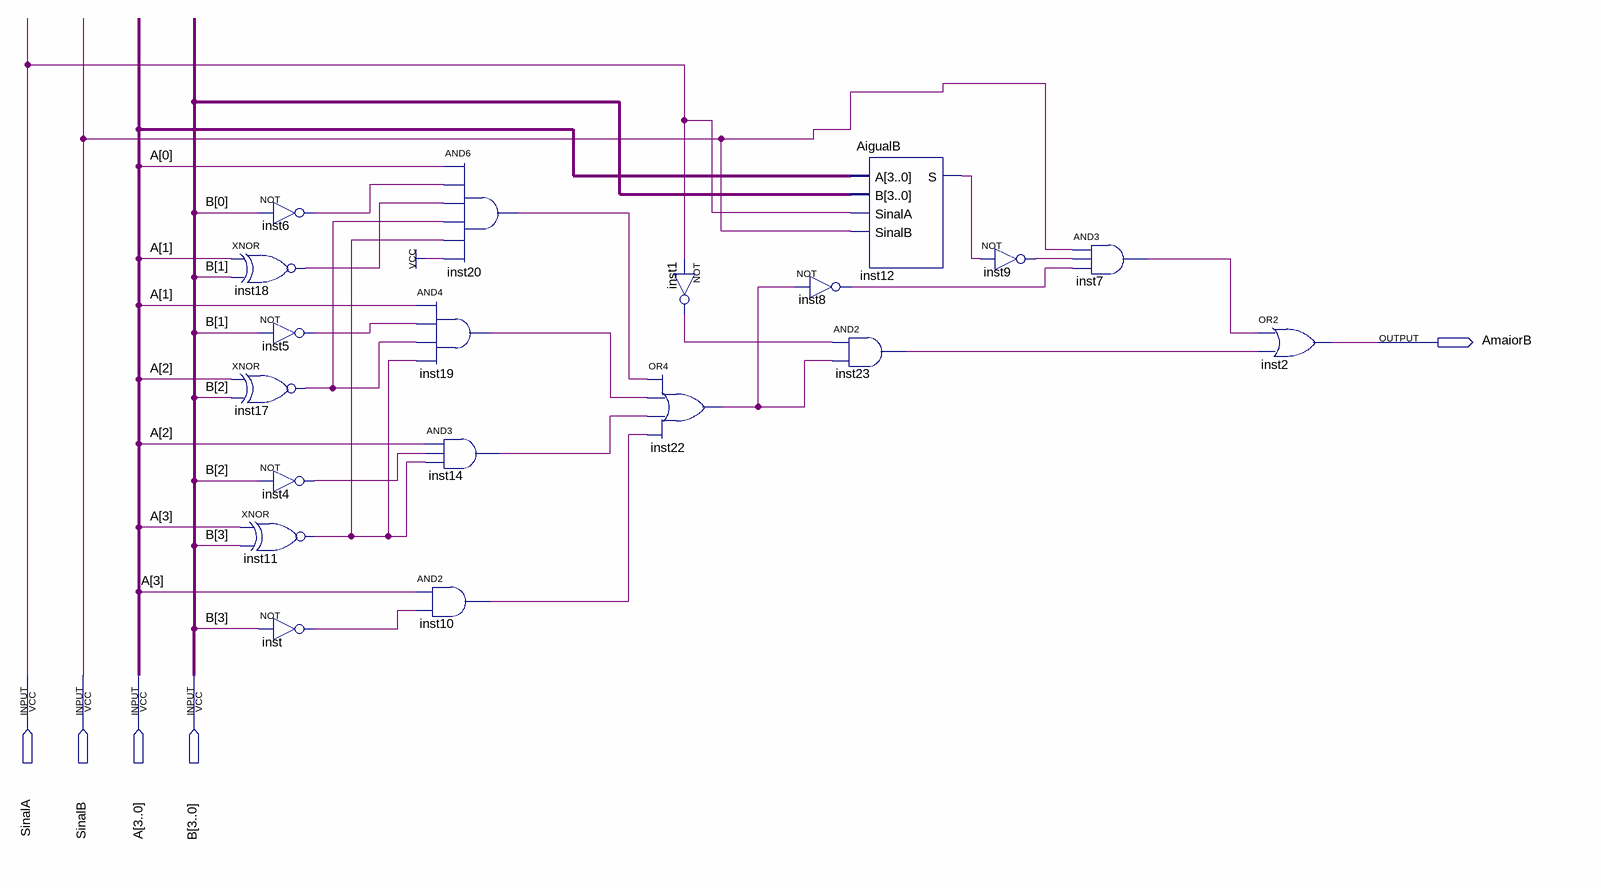
[diagram p0: schematic sheet]
// Quartus schematic AmaiorB.bdf as structural Verilog: 19 symbols, 5 pins
module AmaiorB (
  input  SinalA,
  input  SinalB,
  input  [3:0] A,
  input  [3:0] B,
  output AmaiorB
);

  wire inst1_out, inst4_out, inst5_out, inst6_out, inst7_out, inst8_out, inst9_out, inst10_out, inst11_out,
       inst12_s, inst14_out, inst17_out, inst18_out, inst19_out, inst20_out, inst22_out, inst23_out, inst_out;

  not inst6 (inst6_out, B[0]);
  xnor inst18 (inst18_out, A[1], B[1]);
  not inst5 (inst5_out, B[1]);
  xnor inst17 (inst17_out, A[2], B[2]);
  not inst4 (inst4_out, B[2]);
  xnor inst11 (inst11_out, A[3], B[3]);
  not inst (inst_out, B[3]);
  and inst20 (inst20_out, A[0], inst6_out, inst18_out, inst17_out, inst11_out, 1'b1);
  and inst19 (inst19_out, A[1], inst5_out, inst17_out, inst11_out);
  and inst14 (inst14_out, A[2], inst4_out, inst11_out);
  and inst10 (inst10_out, A[3], inst_out);
  not inst1 (inst1_out, SinalA);
  or inst22 (inst22_out, inst20_out, inst19_out, inst14_out, inst10_out);
  AigualB inst12 (.A(A), .B(B), .SinalA(SinalA), .SinalB(SinalB), .S(inst12_s));
  not inst8 (inst8_out, inst22_out);
  and inst23 (inst23_out, inst1_out, inst22_out);
  not inst9 (inst9_out, inst12_s);
  and inst7 (inst7_out, SinalB, inst9_out, inst8_out);
  or inst2 (AmaiorB, inst7_out, inst23_out);
endmodule
